# Altium schematic sheet MOSFETS.SchDoc
size A4; SheetNumber: 5; SheetTotal: 6
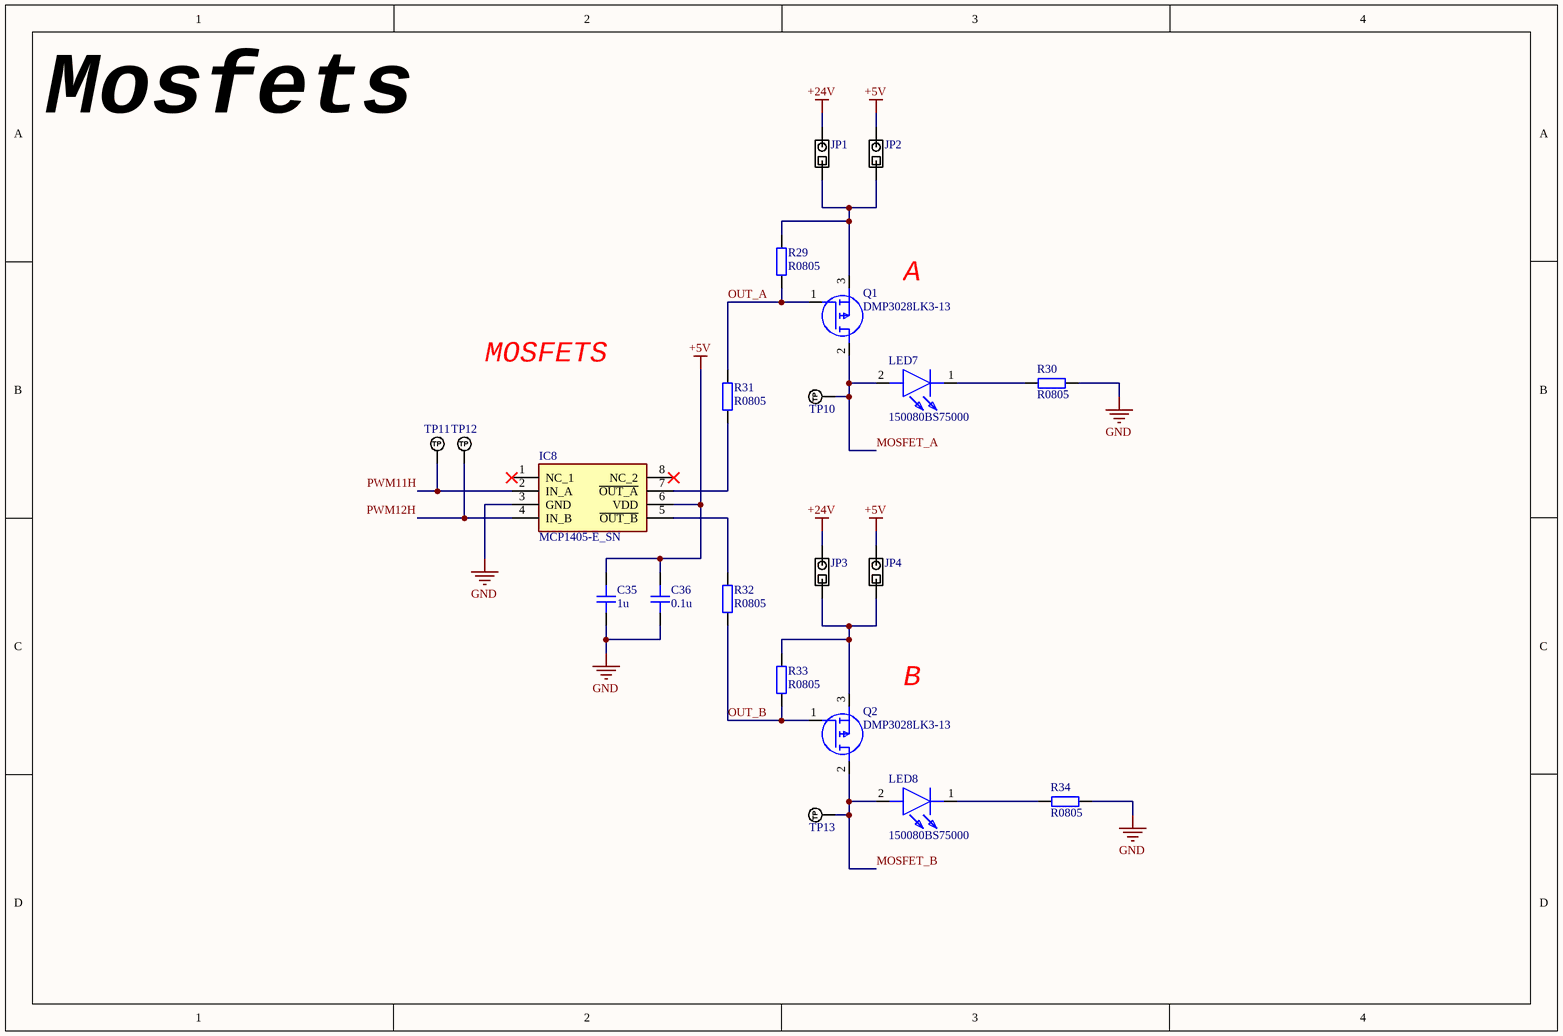
[diagram p0: MOSFETS.SchDoc]

## Parts
C35  1u  [CAP_0805]
C36  0.1u  [CAP_0805]
IC8  MCP1405-E_SN  [SOIC127P600X175-8N]
JP1  Solder Jumper  [SolderJumper_Single]  (value not drawn)
JP2  Solder Jumper  [SolderJumper_Single]  (value not drawn)
JP3  Solder Jumper  [SolderJumper_Single]  (value not drawn)
JP4  Solder Jumper  [SolderJumper_Single]  (value not drawn)
LED7  150080BS75000  [LEDC2012X80N]
LED8  150080BS75000  [LEDC2012X80N]
Q1  DMP3028LK3-13  [DMP3028LK313]
Q2  DMP3028LK3-13  [DMP3028LK313]
R29  R0805  [RES_0805]
R30  R0805  [RES_0805]
R31  R0805  [RES_0805]
R32  R0805  [RES_0805]
R33  R0805  [RES_0805]
R34  R0805  [RES_0805]
TP10  TP_NOBOM  [PAD_RND_1MM]  (value not drawn)  (no BOM)
TP11  TP_NOBOM  [PAD_RND_1MM]  (value not drawn)  (no BOM)
TP12  TP_NOBOM  [PAD_RND_1MM]  (value not drawn)  (no BOM)
TP13  TP_NOBOM  [PAD_RND_1MM]  (value not drawn)  (no BOM)

## Nets
+5V: C35.2 C36.2 IC8.6(VDD) JP2.2 JP4.2
+24V: JP1.2 JP3.2
GND: C35.1 C36.1 IC8.3(GND) R30.1 R34.1
MOSFET_A: LED7.2(A) Q1.2(D) TP10.1(TP)
MOSFET_B: LED8.2(A) Q2.2(D) TP13.1(TP)
OUT_A: Q1.1(G) R29.1 R31.2
OUT_B: Q2.1(G) R32.1 R33.1
PWM11H: IC8.2(IN_A) TP11.1(TP)
PWM12H: IC8.4(IN_B) TP12.1(TP)
NetIC8_5: IC8.5(~{OUT_B}) R32.2
NetIC8_7: IC8.7(~{OUT_A}) R31.1
NetJP1_1: JP1.1 JP2.1 Q1.3(S) R29.2
NetJP3_1: JP3.1 JP4.1 Q2.3(S) R33.2
NetLED7_1: LED7.1(K) R30.2
NetLED8_1: LED8.1(K) R34.2

Not connected (* = marked no-connect by the designer): IC8 1(NC_1)* 8(NC_2)*

## Notes on the sheet
- Mosfets
- A
- MOSFETS
- B

## Library data of the parts
C35 C36 = CAP_0805_10V: Capacitor SMD 0805 10V
IC8 = MCP1405-E_SN: Integrated Circuit; Manufacturer_Name: Microchip; Manufacturer_Part_Number: MCP1405-E/SN; Datasheet Link: https://datasheet.datasheetarchive.com/originals/distributors/SFDatasheet-4/sf-00090019.pdf; Height: 1.75mm; Mouser Part Number: 579-MCP1405-E/SN; Mouser Price/Stock: https://www.mouser.co.uk/ProductDetail/Microchip-Technology/MCP1405-E-SN?qs=usxtMOJb1Rz6iJkGGONxgg%3D%3D; Arrow Part Number: MCP1405-E/SN; Arrow Price/Stock: https://www.arrow.com/en/products/mcp1405-esn/microchip-technology
JP1-JP4 = SolderJumper_Single: Solder Jumper Single 0.5mm Pitch
LED7 LED8 = 150080BS75000: LED; Manufacturer_Name: Wurth Elektronik; Datasheet Link: https://katalog.we-online.com/led/datasheet/150080BS75000.pdf; Height: 0.8mm; Manufacturer_Part_Number: 150080BS75000; Mouser Part Number: 710-150080BS75000; Mouser Price/Stock: https://www.mouser.co.uk/ProductDetail/Wurth-Elektronik/150080BS75000?qs=2kOmHSv6VfT2tBo3UPVqAQ%3D%3D
Q1 Q2 = DMP3028LK3-13: MOSFET (P-Channel); Manufacturer_Name: Diodes Inc.; Datasheet Link: https://componentsearchengine.com/Datasheets/1/DMP3028LK3-13.pdf; Height: 2.39mm; Manufacturer_Part_Number: DMP3028LK3-13; Mouser Part Number: 621-DMP3028LK3-13; Mouser Price/Stock: https://www.mouser.co.uk/ProductDetail/Diodes-Incorporated/DMP3028LK3-13?qs=OVC8WVYZliSFpRP3sPErZQ%3D%3D; Arrow Part Number: DMP3028LK3-13; Arrow Price/Stock: https://www.arrow.com/en/products/dmp3028lk3-13/diodes-incorporated
R29-R34 = RES_0805: Resistor SMD 0805
TP10-TP13 = TEST_POINT_RND_1MM: Test Point Round 1mm (NO BOM)